# EAGLE schematic Compute_Bpard-V0.0 (EAGLE 9.6.2)

## Sheet 1 of 4
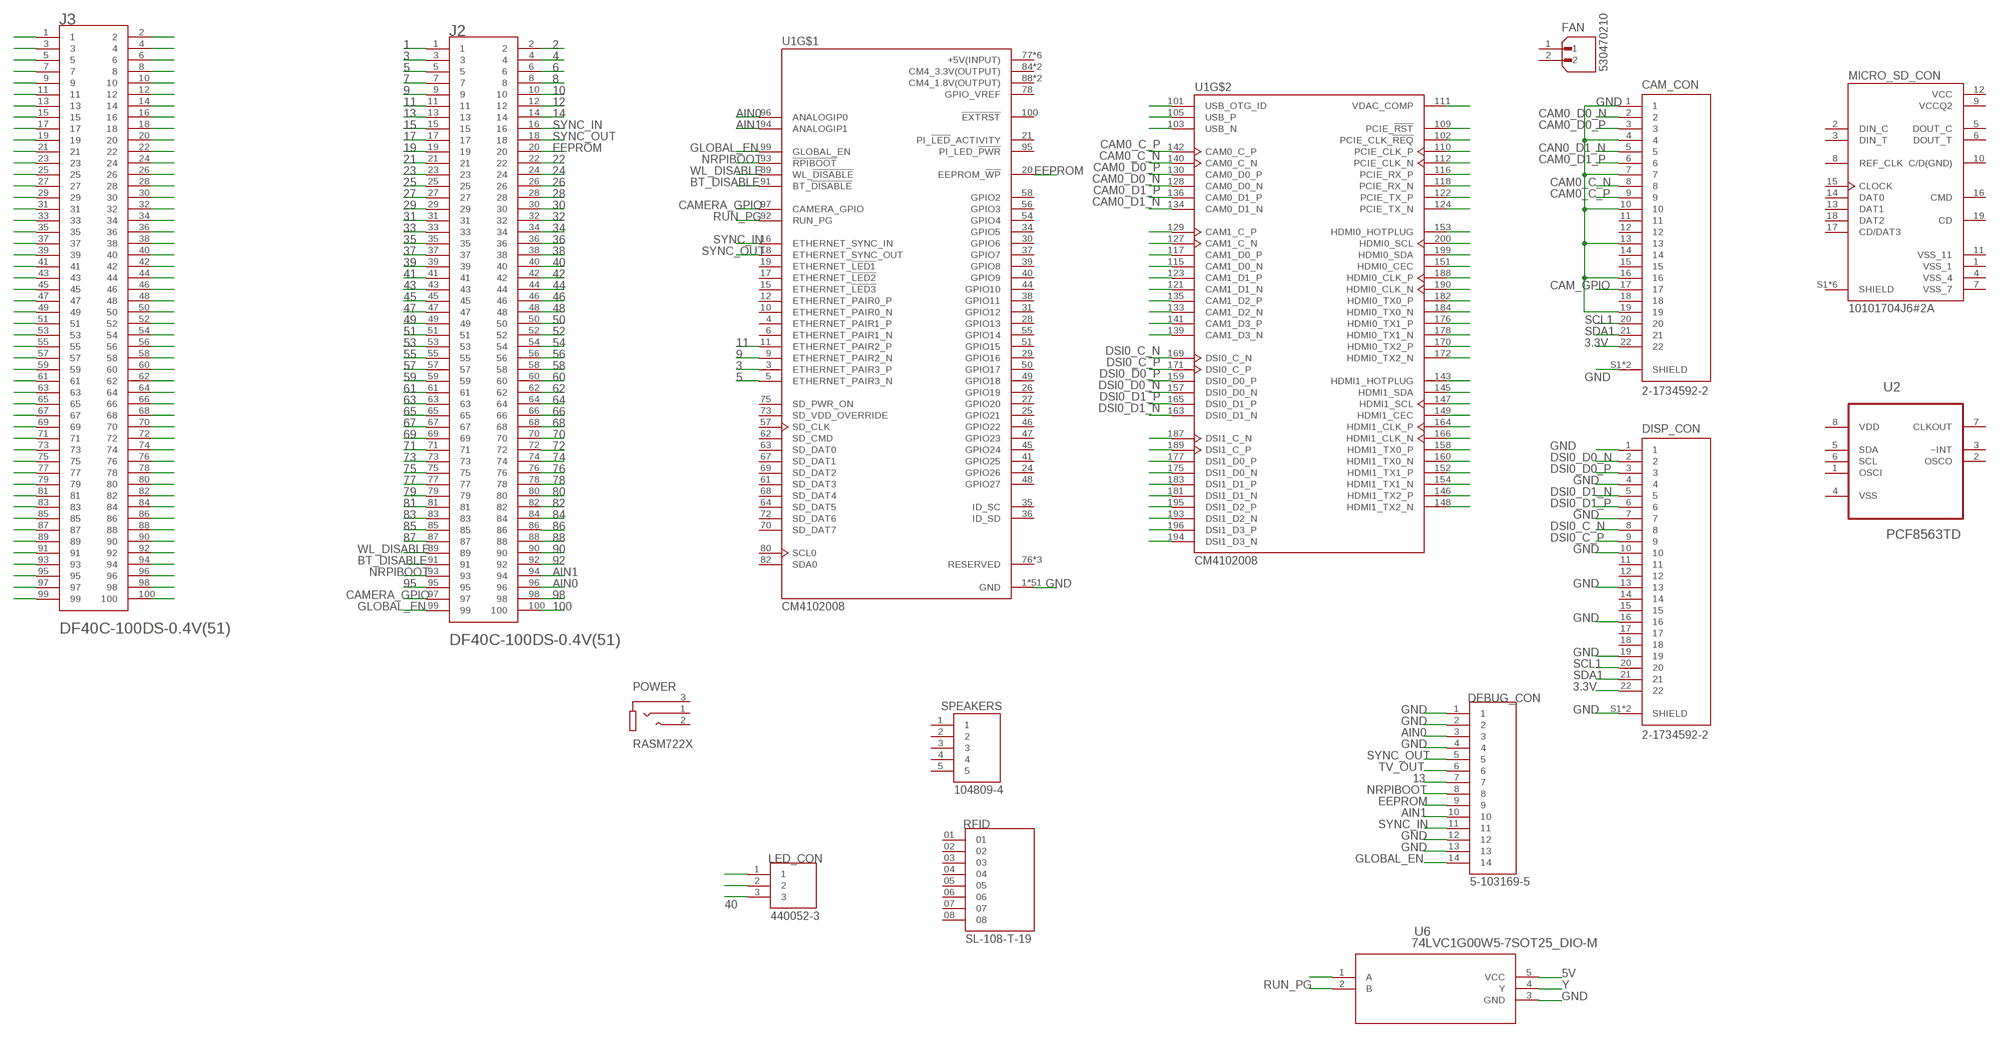
[diagram p0: schematic, sheet 1]

### Parts
CAM_CON  2-1734592-2  [TE_2-1734592-2]
DEBUG_CON  5-103169-5  [TE_5-103169-5]
DISP_CON  2-1734592-2  [TE_2-1734592-2]
FAN  530470210  [MOLEX_530470210]
J2  DF40C-100DS-0.4V(51)  [HRS_DF40C-100DS-0.4V(51)]
J3  DF40C-100DS-0.4V(51)  [HRS_DF40C-100DS-0.4V(51)]
LED_CON  440052-3  [TE_440052-3]
MICRO_SD_CON  10101704J6#2A  [AMPHENOL_10101704J6#2A]
POWER  RASM722X  [SWITCHCRAFT_RASM722X]
RFID  SL-108-T-19  [SAMTEC_SL-108-T-19]
SPEAKERS  104809-4  [TE_104809-4]
U1  CM4102008  [MODULE_CM4102008]
U2  PCF8563TD  [SOIC127P600X175-8N]
U6  74LVC1G00W5-7SOT25_DIO-M  [SOT25_DIO-M]

### Nets
1: J2.1
2: J2.2
3: J2.3 U1.3(ETHERNET_PAIR3_P)
3.3V: CAM_CON.22 DISP_CON.22
4: J2.4
5: J2.5 U1.5(ETHERNET_PAIR3_N)
5V: U6.5(VCC)
6: J2.6
7: J2.7
8: J2.8
9: J2.9 U1.9(ETHERNET_PAIR2_N)
10: J2.10
11: J2.11 U1.11(ETHERNET_PAIR2_P)
12: J2.12
13: DEBUG_CON.7 J2.13
14: J2.14
15: J2.15
17: J2.17
19: J2.19
21: J2.21
22: J2.22
23: J2.23
24: J2.24
25: J2.25
26: J2.26
27: J2.27
28: J2.28
29: J2.29
30: J2.30
31: J2.31
32: J2.32
33: J2.33
34: J2.34
35: J2.35
36: J2.36
37: J2.37
38: J2.38
39: J2.39
40: J2.40 LED_CON.3
41: J2.41
42: J2.42
43: J2.43
44: J2.44
45: J2.45
46: J2.46
47: J2.47
48: J2.48
49: J2.49
50: J2.50
51: J2.51
52: J2.52
53: J2.53
54: J2.54
55: J2.55
56: J2.56
57: J2.57
58: J2.58
59: J2.59
60: J2.60
61: J2.61
62: J2.62
63: J2.63
64: J2.64
65: J2.65
66: J2.66
67: J2.67
68: J2.68
69: J2.69
70: J2.70
71: J2.71
72: J2.72
73: J2.73
74: J2.74
75: J2.75
76: J2.76
77: J2.77
78: J2.78
79: J2.79
80: J2.80
81: J2.81
82: J2.82
83: J2.83
84: J2.84
85: J2.85
86: J2.86
87: J2.87
88: J2.88
90: J2.90
92: J2.92
95: J2.95
98: J2.98
100: J2.100
AIN0: DEBUG_CON.3 J2.96 U1.96(ANALOGIP0)
AIN1: DEBUG_CON.10 J2.94 U1.94(ANALOGIP1)
BT_DISABLE: J2.91 U1.91(BT_!DISABLE)
CAM0_C_N: CAM_CON.8 U1.140(CAM0_C_N)
CAM0_C_P: CAM_CON.9 U1.142(CAM0_C_P)
CAM0_D0_N: CAM_CON.2 U1.128(CAM0_D0_N)
CAM0_D0_P: CAM_CON.3 U1.130(CAM0_D0_P)
CAM0_D1_N: U1.134(CAM0_D1_N)
CAM0_D1_P: CAM_CON.6 U1.136(CAM0_D1_P)
CAM_GPIO: CAM_CON.17
CAMERA_GPIO: J2.97 U1.97(CAMERA_GPIO)
CAN0_D1_N: CAM_CON.5
DSI0_C_N: DISP_CON.8 U1.169(DSI0_C_N)
DSI0_C_P: DISP_CON.9 U1.171(DSI0_C_P)
DSI0_D0_N: DISP_CON.2 U1.157(DSI0_D0_N)
DSI0_D0_P: DISP_CON.3 U1.159(DSI0_D0_P)
DSI0_D1_N: DISP_CON.5 U1.163(DSI0_D1_N)
DSI0_D1_P: DISP_CON.6 U1.165(DSI0_D1_P)
EEPROM: DEBUG_CON.9 J2.20 U1.20(EEPROM_!WP)
GLOBAL_EN: DEBUG_CON.14 J2.99 U1.99(GLOBAL_EN)
GND: CAM_CON.1 CAM_CON.4 CAM_CON.7 CAM_CON.10 CAM_CON.13 CAM_CON.16 CAM_CON.19 CAM_CON.S1(SHIELD) CAM_CON.S2(SHIELD) DEBUG_CON.1 DEBUG_CON.2 DEBUG_CON.4 DEBUG_CON.12 DEBUG_CON.13 DISP_CON.1 DISP_CON.4 DISP_CON.7 DISP_CON.10 DISP_CON.13 DISP_CON.16 DISP_CON.19 DISP_CON.S1(SHIELD) DISP_CON.S2(SHIELD) U1.1(GND) U1.2(GND) U1.7(GND) U1.8(GND) U1.13(GND) U1.14(GND) U1.22(GND) U1.23(GND) U1.32(GND) U1.33(GND) U1.42(GND) U1.43(GND) U1.52(GND) U1.53(GND) U1.59(GND) U1.60(GND) U1.65(GND) U1.66(GND) U1.71(GND) U1.74(GND) U1.98(GND) U1.107(GND) U1.108(GND) U1.113(GND) U1.114(GND) U1.119(GND) U1.120(GND) U1.125(GND) U1.126(GND) U1.131(GND) U1.132(GND) U1.137(GND) U1.138(GND) U1.144(GND) U1.150(GND) U1.155(GND) U1.156(GND) U1.161(GND) U1.162(GND) U1.167(GND) U1.168(GND) U1.173(GND) U1.174(GND) U1.179(GND) U1.180(GND) U1.185(GND) U1.186(GND) U1.191(GND) U1.192(GND) U1.197(GND) U1.198(GND) U6.3(GND) ; also sheet 2
N$11: U6.1(A)
N$12: LED_CON.2
N$13: LED_CON.1
N$54: U1.101(USB_OTG_ID) U1.102(PCIE_CLK_!REQ) U1.103(USB_N) U1.105(USB_P) U1.109(PCIE_!RST) U1.110(PCIE_CLK_P) U1.111(VDAC_COMP) U1.112(PCIE_CLK_N) U1.115(CAM1_D0_N) U1.116(PCIE_RX_P) U1.117(CAM1_D0_P) U1.118(PCIE_RX_N) U1.121(CAM1_D1_N) U1.122(PCIE_TX_P) U1.123(CAM1_D1_P) U1.124(PCIE_TX_N) U1.127(CAM1_C_N) U1.129(CAM1_C_P) U1.133(CAM1_D2_N) U1.135(CAM1_D2_P) U1.139(CAM1_D3_N) U1.141(CAM1_D3_P) U1.143(HDMI1_HOTPLUG) U1.145(HDMI1_SDA) U1.146(HDMI1_TX2_P) U1.147(HDMI1_SCL) U1.148(HDMI1_TX2_N) U1.149(HDMI1_CEC) U1.151(HDMI0_CEC) U1.152(HDMI1_TX1_P) U1.153(HDMI0_HOTPLUG) U1.154(HDMI1_TX1_N) U1.158(HDMI1_TX0_P) U1.160(HDMI1_TX0_N) U1.164(HDMI1_CLK_P) U1.166(HDMI1_CLK_N) U1.170(HDMI0_TX2_P) U1.172(HDMI0_TX2_N) U1.175(DSI1_D0_N) U1.176(HDMI0_TX1_P) U1.177(DSI1_D0_P) U1.178(HDMI0_TX1_N) U1.181(DSI1_D1_N) U1.182(HDMI0_TX0_P) U1.183(DSI1_D1_P) U1.184(HDMI0_TX0_N) U1.187(DSI1_C_N) U1.188(HDMI0_CLK_P) U1.189(DSI1_C_P) U1.190(HDMI0_CLK_N) U1.193(DSI1_D2_N) U1.194(DSI1_D3_N) U1.195(DSI1_D2_P) U1.196(DSI1_D3_P) U1.199(HDMI0_SDA) U1.200(HDMI0_SCL)
N$69: J3.1 J3.3 J3.5 J3.7 J3.9 J3.11 J3.13 J3.15 J3.17 J3.19 J3.21
N$70: J3.23 J3.25 J3.27 J3.29 J3.31 J3.33 J3.35 J3.37 J3.39 J3.41 J3.43
N$71: J3.45 J3.47 J3.49 J3.51 J3.53 J3.55 J3.57 J3.59 J3.61 J3.63 J3.65
N$72: J3.67 J3.69 J3.71 J3.73 J3.75 J3.77 J3.79 J3.81 J3.83 J3.85 J3.87
N$73: J3.89 J3.91 J3.93 J3.95 J3.97 J3.99
N$82: J3.2
N$83: J3.4
N$84: J3.6
N$85: J3.8
N$86: J3.10
N$87: J3.12
N$88: J3.14
N$89: J3.16
N$90: J3.18
N$91: J3.20
N$92: J3.22
N$93: J3.24
N$94: J3.26
N$95: J3.28
N$96: J3.30
N$97: J3.32
N$98: J3.34
N$99: J3.36
N$100: J3.38
N$101: J3.40
N$102: J3.42
N$103: J3.44
N$104: J3.46
N$105: J3.48
N$106: J3.50
N$107: J3.52
N$108: J3.54
N$109: J3.56
N$110: J3.58
N$111: J3.60
N$112: J3.62
N$113: J3.64
N$114: J3.66
N$115: J3.68
N$116: J3.70
N$117: J3.72
N$118: J3.74
N$119: J3.76
N$120: J3.78
N$121: J3.80
N$122: J3.82
N$123: J3.84
N$124: J3.86
N$125: J3.88
N$126: J3.90
N$127: J3.92
N$128: J3.94
N$129: J3.96
N$130: J3.98
N$131: J3.100
NRPIBOOT: DEBUG_CON.8 J2.93 U1.93(!RPIBOOT)
RUN_PG: U1.92(RUN_PG) U6.2(B)
SCL1: CAM_CON.20 DISP_CON.20
SDA1: CAM_CON.21 DISP_CON.21
SYNC_IN: DEBUG_CON.11 J2.16 U1.16(ETHERNET_SYNC_IN)
SYNC_OUT: DEBUG_CON.5 J2.18 U1.18(ETHERNET_SYNC_OUT)
TV_OUT: DEBUG_CON.6
WL_DISABLE: J2.89 U1.89(WL_!DISABLE)
Y: U6.4(Y)
Unconnected: CAM_CON.11 CAM_CON.12 CAM_CON.14 CAM_CON.15 CAM_CON.18 DISP_CON.11 DISP_CON.12 DISP_CON.14 DISP_CON.15 DISP_CON.17 DISP_CON.18 FAN.1 FAN.2 MICRO_SD_CON.2(DIN_C) MICRO_SD_CON.3(DIN_T) MICRO_SD_CON.5(DOUT_C) MICRO_SD_CON.6(DOUT_T) MICRO_SD_CON.8(REF_CLK) MICRO_SD_CON.10(C/D(GND)) MICRO_SD_CON.13(DAT1) MICRO_SD_CON.14(DAT0) MICRO_SD_CON.15(CLOCK) MICRO_SD_CON.16(CMD) MICRO_SD_CON.17(CD/DAT3) MICRO_SD_CON.18(DAT2) MICRO_SD_CON.19(CD) MICRO_SD_CON.S1(SHIELD) MICRO_SD_CON.S2(SHIELD) MICRO_SD_CON.S3(SHIELD) MICRO_SD_CON.S4(SHIELD) MICRO_SD_CON.S5(SHIELD) MICRO_SD_CON.S6(SHIELD) POWER.1(SHUNT) POWER.2(TIP) POWER.3(SLEEVE) RFID.01 RFID.02 RFID.03 RFID.04 RFID.05 RFID.06 RFID.07 RFID.08 SPEAKERS.1 SPEAKERS.2 SPEAKERS.3 SPEAKERS.4 SPEAKERS.5 U1.4(ETHERNET_PAIR1_P) U1.6(ETHERNET_PAIR1_N) U1.10(ETHERNET_PAIR0_N) U1.12(ETHERNET_PAIR0_P) U1.15(ETHERNET_!LED3) U1.17(ETHERNET_!LED2) U1.19(ETHERNET_!LED1) U1.21(PI_!LED!_ACTIVITY) U1.24(GPIO26) U1.25(GPIO21) U1.26(GPIO19) U1.27(GPIO20) U1.28(GPIO13) U1.29(GPIO16) U1.30(GPIO6) U1.31(GPIO12) U1.34(GPIO5) U1.35(ID_SC) U1.36(ID_SD) U1.37(GPIO7) U1.38(GPIO11) U1.39(GPIO8) U1.40(GPIO9) U1.41(GPIO25) U1.44(GPIO10) U1.45(GPIO24) U1.46(GPIO22) U1.47(GPIO23) U1.48(GPIO27) U1.49(GPIO18) U1.50(GPIO17) U1.51(GPIO15) U1.54(GPIO4) U1.55(GPIO14) U1.56(GPIO3) U1.57(SD_CLK) U1.58(GPIO2) U1.61(SD_DAT3) U1.62(SD_CMD) U1.63(SD_DAT0) U1.64(SD_DAT5) U1.67(SD_DAT1) U1.68(SD_DAT4) U1.69(SD_DAT2) U1.70(SD_DAT7) U1.72(SD_DAT6) U1.73(SD_VDD_OVERRIDE) U1.75(SD_PWR_ON) U1.76(RESERVED) U1.80(SCL0) U1.82(SDA0) U1.95(PI_LED_!PWR) U1.100(!EXTRST) U1.104(RESERVED) U1.106(RESERVED) U2.1(OSCI) U2.2(OSCO) U2.3(~INT) U2.5(SDA) U2.6(SCL) U2.7(CLKOUT)

## Sheet 2 of 4
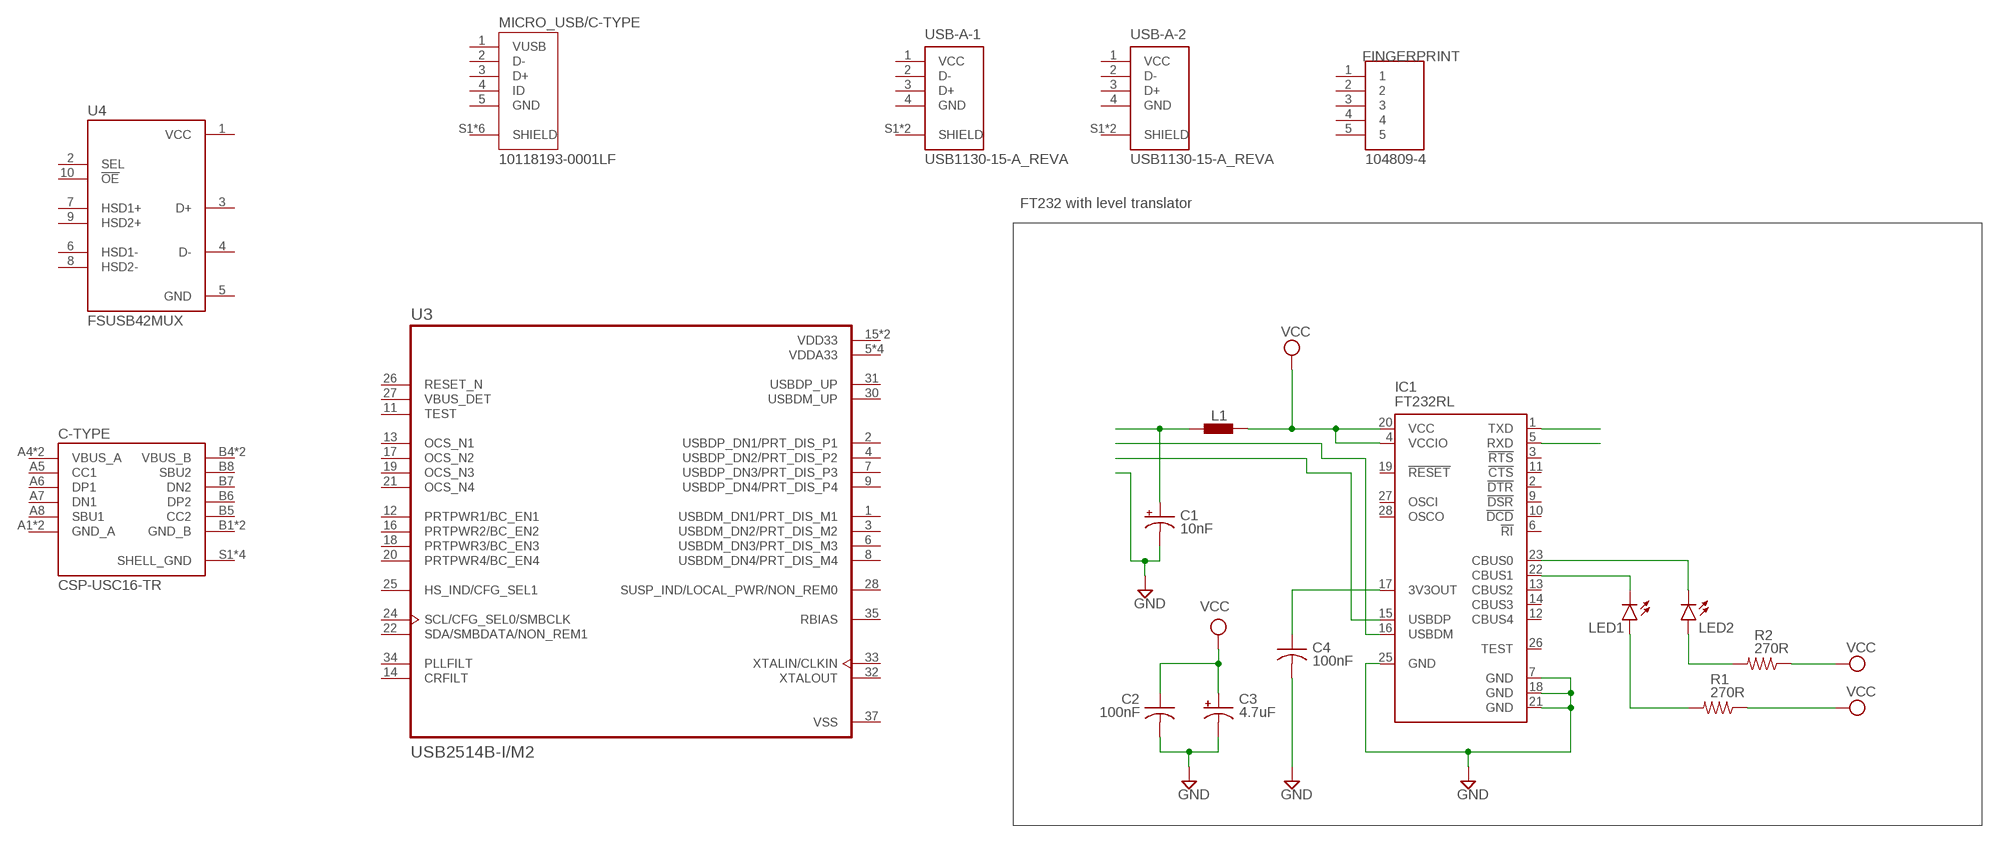
[diagram p1: schematic, sheet 2]

### Parts
C1  10nF  CPOL-US085CS-1AR  [085CS_1AR]
C2  100nF  C-US025-024X044  [C025-024X044]
C3  4.7uF  CPOL-US085CS-1AR  [085CS_1AR]
C4  100nF  C-US025-024X044  [C025-024X044]
C-TYPE  CSP-USC16-TR  [VALCON_CSP-USC16-TR]
FINGERPRINT  104809-4  [TE_104809-4]
IC1  FT232RL  [SSOP28]
L1  BLM15HB121SN1  [0402]
LED1  LEDSMT1206  [1206]
LED2  LEDSMT1206  [1206]
MICRO_USB/C-TYPE  10118193-0001LF  [FCI_10118193-0001LF]
R1  270R  R-US_0204/2V  [0204V]
R2  270R  R-US_0204/2V  [0204V]
U3  USB2514B-I/M2  [QFN50P600X600X100-37N]
U4  FSUSB42MUX  [SOP50P490X110-10N]
USB-A-1  USB1130-15-A_REVA  [GCT_USB1130-15-A_REVA]
USB-A-2  USB1130-15-A_REVA  [GCT_USB1130-15-A_REVA]

### Nets
GND: C1.- C2.2 C3.- C4.2 IC1.7(GND) IC1.18(GND) IC1.21(GND) IC1.25(GND) ; also sheet 1
N$1: C1.+ L1.1
N$2: IC1.16(USBDM)
N$3: IC1.15(USBDP)
N$4: C4.1 IC1.17(3V3OUT)
N$5: IC1.1(TXD)
N$6: IC1.5(RXD)
N$7: LED2.A R2.2
N$8: LED1.A R1.2
N$9: IC1.23(CBUS0) LED2.C
N$10: IC1.22(CBUS1) LED1.C
VCC: C2.1 C3.+ IC1.4(VCCIO) IC1.20(VCC) L1.2 R1.1 R2.1
Unconnected: C-TYPE.A5(CC1) C-TYPE.A6(DP1) C-TYPE.A7(DN1) C-TYPE.A8(SBU1) C-TYPE.B5(CC2) C-TYPE.B6(DP2) C-TYPE.B7(DN2) C-TYPE.B8(SBU2) FINGERPRINT.1 FINGERPRINT.2 FINGERPRINT.3 FINGERPRINT.4 FINGERPRINT.5 IC1.2(!DTR) IC1.3(!RTS) IC1.6(!RI) IC1.9(!DSR) IC1.10(!DCD) IC1.11(!CTS) IC1.12(CBUS4) IC1.13(CBUS2) IC1.14(CBUS3) IC1.19(!RESET) IC1.26(TEST) IC1.27(OSCI) IC1.28(OSCO) MICRO_USB/C-TYPE.1(VUSB) MICRO_USB/C-TYPE.2(D-) MICRO_USB/C-TYPE.3(D+) MICRO_USB/C-TYPE.4(ID) MICRO_USB/C-TYPE.5(GND) MICRO_USB/C-TYPE.S1(SHIELD) MICRO_USB/C-TYPE.S2(SHIELD) MICRO_USB/C-TYPE.S3(SHIELD) MICRO_USB/C-TYPE.S4(SHIELD) MICRO_USB/C-TYPE.S5(SHIELD) MICRO_USB/C-TYPE.S6(SHIELD) U3.1(USBDM_DN1/PRT_DIS_M1) U3.2(USBDP_DN1/PRT_DIS_P1) U3.3(USBDM_DN2/PRT_DIS_M2) U3.4(USBDP_DN2/PRT_DIS_P2) U3.6(USBDM_DN3/PRT_DIS_M3) U3.7(USBDP_DN3/PRT_DIS_P3) U3.8(USBDM_DN4/PRT_DIS_M4) U3.9(USBDP_DN4/PRT_DIS_P4) U3.11(TEST) U3.12(PRTPWR1/BC_EN1) U3.13(OCS_N1) U3.14(CRFILT) U3.16(PRTPWR2/BC_EN2) U3.17(OCS_N2) U3.18(PRTPWR3/BC_EN3) U3.19(OCS_N3) U3.20(PRTPWR4/BC_EN4) U3.21(OCS_N4) U3.22(SDA/SMBDATA/NON_REM1) U3.24(SCL/CFG_SEL0/SMBCLK) U3.25(HS_IND/CFG_SEL1) U3.26(RESET_N) U3.27(VBUS_DET) U3.28(SUSP_IND/LOCAL_PWR/NON_REM0) U3.30(USBDM_UP) U3.31(USBDP_UP) U3.32(XTALOUT) U3.33(XTALIN/CLKIN) U3.34(PLLFILT) U3.35(RBIAS) U4.2(SEL) U4.3(D+) U4.4(D-) U4.6(HSD1-) U4.7(HSD1+) U4.8(HSD2-) U4.9(HSD2+) U4.10(!OE) USB-A-1.2(D-) USB-A-1.3(D+) USB-A-1.S1(SHIELD) USB-A-1.S2(SHIELD) USB-A-2.2(D-) USB-A-2.3(D+) USB-A-2.S1(SHIELD) USB-A-2.S2(SHIELD)

### Notes on the sheet
- FT232 with level translator

## Sheet 3 of 4
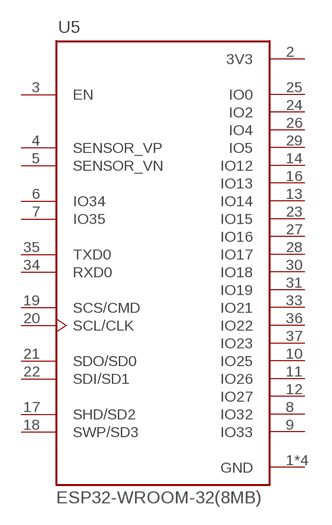
[diagram p2: schematic, sheet 3]

### Parts
U5  ESP32-WROOM-32(8MB)  [MODULE_ESP32-WROOM-32(8MB)]
Unconnected: U5.3(EN) U5.4(SENSOR_VP) U5.5(SENSOR_VN) U5.6(IO34) U5.7(IO35) U5.8(IO32) U5.9(IO33) U5.10(IO25) U5.11(IO26) U5.12(IO27) U5.13(IO14) U5.14(IO12) U5.16(IO13) U5.17(SHD/SD2) U5.18(SWP/SD3) U5.19(SCS/CMD) U5.20(SCL/CLK) U5.21(SDO/SD0) U5.22(SDI/SD1) U5.23(IO15) U5.24(IO2) U5.25(IO0) U5.26(IO4) U5.27(IO16) U5.28(IO17) U5.29(IO5) U5.30(IO18) U5.31(IO19) U5.33(IO21) U5.34(RXD0) U5.35(TXD0) U5.36(IO22) U5.37(IO23)

## Sheet 4 of 4
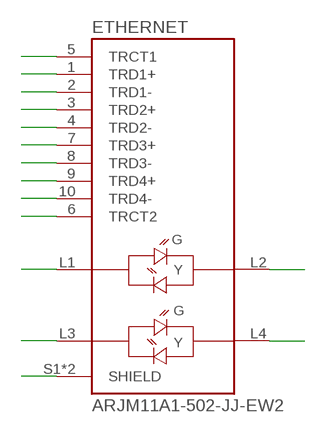
[diagram p3: schematic, sheet 4]

### Parts
ETHERNET  ARJM11A1-502-JJ-EW2  [ABRACON_ARJM11A1-502-JJ-EW2]

### Nets
N$24: ETHERNET.5(TRCT1)
N$25: ETHERNET.1(TRD1+)
N$26: ETHERNET.2(TRD1-)
N$27: ETHERNET.3(TRD2+)
N$28: ETHERNET.4(TRD2-)
N$29: ETHERNET.7(TRD3+)
N$30: ETHERNET.8(TRD3-)
N$31: ETHERNET.9(TRD4+)
N$32: ETHERNET.10(TRD4-)
N$33: ETHERNET.6(TRCT2)
N$34: ETHERNET.L1
N$35: ETHERNET.L2
N$36: ETHERNET.L3
N$37: ETHERNET.L4
N$38: ETHERNET.S1(SHIELD) ETHERNET.S2(SHIELD)

## Power pins joined to a net without a drawn wire
3V3: U5.2(3V3)
+5V(INPUT): U1.77(+5V(INPUT)) U1.79(+5V(INPUT)) U1.81(+5V(INPUT)) U1.83(+5V(INPUT)) U1.85(+5V(INPUT)) U1.87(+5V(INPUT))
CM4_1.8V(OUTPUT): U1.88(CM4_1.8V(OUTPUT)) U1.90(CM4_1.8V(OUTPUT))
CM4_3.3V(OUTPUT): U1.84(CM4_3.3V(OUTPUT)) U1.86(CM4_3.3V(OUTPUT))
GND: U4.5(GND) U5.1(GND) U5.15(GND) U5.38(GND) U5.39(GND) USB-A-1.4(GND) USB-A-2.4(GND)
GND_A: C-TYPE.A1(GND_A) C-TYPE.A12(GND_A)
GND_B: C-TYPE.B1(GND_B) C-TYPE.B12(GND_B)
GPIO_VREF: U1.78(GPIO_VREF)
SHELL_GND: C-TYPE.S1(SHELL_GND) C-TYPE.S2(SHELL_GND) C-TYPE.S3(SHELL_GND) C-TYPE.S4(SHELL_GND)
VBUS_A: C-TYPE.A4(VBUS_A) C-TYPE.A9(VBUS_A)
VBUS_B: C-TYPE.B4(VBUS_B) C-TYPE.B9(VBUS_B)
VCC: MICRO_SD_CON.12(VCC) U4.1(VCC) USB-A-1.1(VCC) USB-A-2.1(VCC)
VCCQ2: MICRO_SD_CON.9(VCCQ2)
VDD: U2.8(VDD)
VDD33: U3.15(VDD33) U3.23(VDD33)
VDDA33: U3.5(VDDA33) U3.10(VDDA33) U3.29(VDDA33) U3.36(VDDA33)
VSS: U2.4(VSS) U3.37(VSS)
VSS_1: MICRO_SD_CON.1(VSS_1)
VSS_4: MICRO_SD_CON.4(VSS_4)
VSS_7: MICRO_SD_CON.7(VSS_7)
VSS_11: MICRO_SD_CON.11(VSS_11)

## Library data of the parts
C1 C3 = rcl:CPOL-US: POLARIZED CAPACITOR, American symbol; SPICEPREFIX: C
C2 C4 = rcl:C-US: CAPACITOR, American symbol; SPICEPREFIX: C
C-TYPE = USB-C:CSP-USC16-TR: Check availability <https://pricing.snapeda.com/parts/CSP-USC16-TR/Valcon/view-part?ref=eda>; AVAILABILITY: In Stock; DESCRIPTION: CSP-USC16-TR Valcon USB Type C Surface Mount PCB Socket; MF: Valcon; MP: CSP-USC16-TR; PACKAGE: None; PRICE: None; PURCHASE-URL: https://pricing.snapeda.com/search/part/CSP-USC16-TR/?ref=eda
CAM_CON DISP_CON = 2-1734592-2:2-1734592-2: Check availability <https://pricing.snapeda.com/parts/2-1734592-2/TE%20Connectivity/view-part?ref=eda>; AVAILABILITY: In Stock; DESCRIPTION: 22 Position FPC Connector Contacts, Bottom 0.020 (0.50mm) Surface Mount, Right Angle; MF: TE Connectivity; MP: 2-1734592-2; PACKAGE: None; PRICE: None; PURCHASE-URL: https://pricing.snapeda.com/search/part/2-1734592-2/?ref=eda
DEBUG_CON = 5-103169-5:5-103169-5: Check availability <https://pricing.snapeda.com/parts/5-103169-5/TE%20Connectivity/view-part?ref=eda>; AVAILABILITY: In Stock; COMMENT: 5-103169-5; DESCRIPTION: AMPMODU 14 Position Through-Hole Dual Row Straight 2.54 mm Shrouded Header; EU_ROHS_COMPLIANCE: Compliant; MF: TE Connectivity; MP: 5-103169-5; PACKAGE: None; PRICE: None; PURCHASE-URL: https://pricing.snapeda.com/search/part/5-103169-5/?ref=eda
ETHERNET = ARJM11A1-502-JJ-EW2:ARJM11A1-502-JJ-EW2: 1 Port RJ45 Magjack Connector Through Hole 10/100/1000 Base-T, AutoMDIX Check availability <https://pricing.snapeda.com/parts/ARJM11A1-502-JJ-EW2/Abracon%20LLC/view-part?ref=eda>; AVAILABILITY: In Stock; DESCRIPTION: 1 Port RJ45 Magjack Connector Through Hole 10/100/1000 Base-T, AutoMDIX; MF: Abracon LLC; MP: ARJM11A1-502-JJ-EW2; PACKAGE: None; PRICE: None; PURCHASE-URL: https://pricing.snapeda.com/search/part/ARJM11A1-502-JJ-EW2/?ref=eda
FAN = 530470210:530470210: Check availability <https://pricing.snapeda.com/parts/530470210/Molex/view-part?ref=eda>; AVAILABILITY: In Stock; DESCRIPTION: Connector Header Through Hole 2 position 0.049 (1.25mm); MF: Molex; MP: 530470210; PACKAGE: None; PRICE: None; PURCHASE-URL: https://pricing.snapeda.com/search/part/530470210/?ref=eda
FINGERPRINT SPEAKERS = 104809-4:104809-4: Check availability <https://pricing.snapeda.com/parts/104809-4/TE%20Connectivity%20AMP%20Connectors/view-part?ref=eda>; AVAILABILITY: In Stock; COMMENT: 104809-4; DESCRIPTION: Connector Header Through Hole 5 position 0.100 (2.54mm); MF: TE Connectivity AMP Connectors; MP: 104809-4; PACKAGE: None; PRICE: None; PURCHASE-URL: https://pricing.snapeda.com/search/part/104809-4/?ref=eda
IC1 = ftdichip:FT232R: Source: http://www.ftdichip.com/Documents/DataSheets/DS_FT232R_v104.pdf; MPN: FT232RL; OC_FARNELL: 1146032; OC_NEWARK: 91K9918
J2 J3 = DF40C-100DS-0.4V_51_:DF40C-100DS-0.4V(51): DF40 Series 100 Position Dual Row 0.4 mm Pitch Surface Mount Vertical Receptacle Check availability <https://pricing.snapeda.com/parts/DF40C-100DS-0.4V%2851%29/Hirose/view-part?ref=eda>; AVAILABILITY: In Stock; DESCRIPTION: 100 Position Connector Receptacle, Center Strip Contacts Surface Mount Gold; MF: Hirose; MP: DF40C-100DS-0.4V(51); PACKAGE: None; PRICE: None; PURCHASE-URL: https://pricing.snapeda.com/search/part/DF40C-100DS-0.4V(51)/?ref=eda
L1 = inductors:BLM15H: EMIFIL (R) Chip Ferrite Bead for GHz Noise Source: http://www.murata.com/ Ferrite Bead BLM15H.pdf
LED1 LED2 = led:LED: LED OSRAM: - CHIPLED LG R971, LG N971, LY N971, LG Q971, LY Q971, LO R971, LY R971 LH N974, LH R974 LS Q976, LO Q976, LY Q976 LO Q996 - Hyper CHIPLED LW Q18S LB Q993, LB Q99A, LB R99A - SideLED LS A670, LO A670, LY A670, LG A670, LP A670 LB A673, LV A673, LT A673, LW A673 LH A674 LY A675 LS A676, LA A676, LO A676, LY A676, LW A676 LS A679, LY A679, LG A679 - Hyper Micro SIDELED® LS Y876, LA Y876, LO Y876, LY Y876 LT Y87S - SmartLED LW L88C, LW L88S LB L89C, LB L89S, LG L890 LS L89K, LO L89K, LY L89K LS L896, LA L896, LO L896, LY L896 - TOPLED LS T670, LO T670, LY T670, LG T670, LP T670 LSG T670, LSP T670, LSY T670, LOP T670, LYG T670 LG T671, LOG T671, LSG T671 LB T673, LV T673, LT T673, LW T673 LH T674 LS T676, LA T676, LO T676, LY T676, LB T676, LH T676, LSB T676, LW T676 LB T67C, LV T67C, LT T67C, LS T67K, LO T67K, LY T67K, LW E67C LS E67B, LA E67B, LO E67B, LY E67B, LB E67C, LV E67C, LT E67C LW T67C LS T679, LY T679, LG T679 LS T770, LO T770, LY T770, LG T770, LP T770 LB T773, LV T773, LT T773, LW T773 LH T774 LS E675, LA E675, LY E675, LS T675 LS T776, LA T776, LO T776, LY T776, LB T776 LHGB T686 LT T68C, LB T68C - Hyper Mini TOPLED® LB M676 - Mini TOPLED Santana® LG M470 LS M47K, LO M47K, LY M47K Source: http://www.osram.convergy.de LUXEON: - LUMILED® LXK2-PW12-R00, LXK2-PW12-S00, LXK2-PW14-U00, LXK2-PW14-V00 LXK2-PM12-R00, LXK2-PM12-S00, LXK2-PM14-U00 LXK2-PE12-Q00, LXK2-PE12-R00, LXK2-PE12-S00, LXK2-PE14-T00, LXK2-PE14-U00 LXK2-PB12-K00, LXK2-PB12-L00, LXK2-PB12-M00, LXK2-PB14-N00, LXK2-PB14-P00, LXK2-PB14-Q00 LXK2-PR12-L00, LXK2-PR12-M00, LXK2-PR14-Q00, LXK2-PR14-R00 LXK2-PD12-Q00, LXK2-PD12-R00, LXK2-PD12-S00 LXK2-PH12-R00, LXK2-PH12-S00 LXK2-PL12-P00, LXK2-PL12-Q00, LXK2-PL12-R00 Source: www.luxeon.com KINGBRIGHT: KA-3528ASYC Source: www.kingbright.com
LED_CON = 440052-3:440052-3: Check availability <https://pricing.snapeda.com/parts/440052-3/TE%20Connectivity/view-part?ref=eda>; AVAILABILITY: In Stock; COMMENT: 440052-3; DESCRIPTION: 2.5MM,HDR,3POS,VERTICAL, CONNECTOR; EU_ROHS_COMPLIANCE: Compliant; MF: TE Connectivity; MP: 440052-3; PACKAGE: None; PRICE: None; PURCHASE-URL: https://pricing.snapeda.com/search/part/440052-3/?ref=eda
MICRO_SD_CON = SD_Card:10101704J6#2A: Check availability <https://pricing.snapeda.com/parts/10101704J6%232A/Amphenol%20Commercial%20Products/view-part?ref=eda>; AVAILABILITY: In Stock; DESCRIPTION: Universal Flash Storage (UFS) Connector, Input Output Connectors, UFS card high speed Socket, push-pull, SMT,compatible with Micro SD, Pd-NI 12μin +2μin gold.; MF: Amphenol Commercial Products; MP: 10101704J6#2A; PACKAGE: None; PRICE: None; PURCHASE-URL: https://pricing.snapeda.com/search/part/10101704J6#2A/?ref=eda
MICRO_USB/C-TYPE = Micro_USB:10118193-0001LF: Micro USB B Type Receptacle Check availability <https://pricing.snapeda.com/parts/10118193-0001LF/FCI/view-part?ref=eda>; AVAILABILITY: In Stock; DESCRIPTION: USB - micro B USB 2.0 Receptacle Connector 5 Position Surface Mount, Right Angle; Through Hole; MF: FCI; MP: 10118193-0001LF; PACKAGE: None; PRICE: None; PURCHASE-URL: https://pricing.snapeda.com/search/part/10118193-0001LF/?ref=eda
POWER = RASM722X:RASM722X: Check availability <https://pricing.snapeda.com/parts/RASM722X/Switchcraft/view-part?ref=eda>; AVAILABILITY: In Stock; DESCRIPTION: JACK SOCKET, DC; Gender:Jack; Current Rating:5A; Pin Diameter:2mm; Barrel Length:-; Connector Mounting:Surface Mount; Contact Termination Type:Solder; Barrel Inner Diameter:-; Barrel Outer Diameter:6.3mm; Voltage Rating:-; Product Range:-; SVHC:No SVHC (15-Jan-2018); Contact Termination:Solder; Termination Method:Solder; Voltage Rating VAC:250V; MF: Switchcraft; MP: RASM722X; PACKAGE: None; PRICE: None; PURCHASE-URL: https://pricing.snapeda.com/search/part/RASM722X/?ref=eda
R1 R2 = rcl:R-US_: RESISTOR, American symbol; SPICEPREFIX: R
RFID = SL-108-T-19:SL-108-T-19: Check availability <https://pricing.snapeda.com/parts/SL-108-T-19/Samtec/view-part?ref=eda>; AVAILABILITY: In Stock; DESCRIPTION: 8 Position Receptacle Connector 0.100 (2.54mm) Through Hole Gold; MF: Samtec; MP: SL-108-T-19; PACKAGE: None; PRICE: None; PURCHASE-URL: https://pricing.snapeda.com/search/part/SL-108-T-19/?ref=eda
U1 = RPi-CM4102008:CM4102008: RPI MODULE 4, 2GB RAM, 8GB EMMC, WIFI; Silicon Manufacturer:Broadcom; Silicon Family Name:BCM2xxx; Core Architecture:ARM; Core Sub-Architecture:Cortex-A72; Silicon Core Number:BCM2711; Product Range:Compute Module 4 RoHS Compliant: Yes Check availability <https://pricing.snapeda.com/parts/CM4102008/Raspberry%20Pi/view-part?ref=eda>; AVAILABILITY: Not in stock; DESCRIPTION: RPI MODULE 4, 2GB RAM, 8GB EMMC, WIFI; Silicon Manufacturer:Broadcom; Silicon Family Name:BCM2xxx; Core Architecture:ARM; Core Sub-Architecture:Cortex-A72; Silicon Core Number:BCM2711; Product Range:Compute Module 4 RoHS Compliant: Yes; MF: Raspberry Pi; MP: CM4102008; PACKAGE: None; PRICE: None
U2 = PCF8563TD:PCF8563TD: Real time clock/calendar Check availability <https://pricing.snapeda.com/parts/PCF8563TD/NXP%20USA/view-part?ref=eda>; AVAILABILITY: Not in stock; DESCRIPTION: Real Time Clock (RTC) IC; Date Format:Binary; Time Format:BCD; Interface:I2C; RTC Features:Provides year, month, day, weekday, hours, minutes and seconds; Clock IC Type:RTC; Supply Voltage Min:1.8V; Supply Voltage Max:5.5V ;RoHS Compliant: Yes; MF: NXP USA; MP: PCF8563TD; PACKAGE: SOIC-8 NXP Semiconductors; PRICE: None
U3 = USB2514B-I_M2:USB2514B-I/M2: None Check availability <https://pricing.snapeda.com/parts/USB2514B-I/M2/Microchip/view-part?ref=eda>; AVAILABILITY: In Stock; DESCRIPTION: USB Hub Controller - USB Interface 36-SQFN (6x6); MF: Microchip; MP: USB2514B-I/M2; PACKAGE: VQFN-36 Microchip; PRICE: None; PURCHASE-URL: https://pricing.snapeda.com/search/part/USB2514B-I/M2/?ref=eda
U4 = FSUSB42MUX:FSUSB42MUX: Low Power, Two port, High speed, USB 2.0(480Mbps) UART switch MSOP-10 Check availability <https://pricing.snapeda.com/parts/FSUSB42MUX/ON%20Semiconductor/view-part?ref=eda>; AVAILABILITY: In Stock; DESCRIPTION: FSUSB42 Series DPDT 4.3 V 480 Mbps SMT Hi Speed USB 2.0 Switch - MSOP-10; MF: ON Semiconductor; MP: FSUSB42MUX; PACKAGE: MSOP-10 ON Semiconductor; PRICE: None; PURCHASE-URL: https://pricing.snapeda.com/search/part/FSUSB42MUX/?ref=eda
U5 = ESP32-WROOM-32_8MB_:ESP32-WROOM-32(8MB): WIFI MODULE 64 MBITS SPI FLASH Check availability <https://pricing.snapeda.com/parts/ESP32-WROOM-32%20%288MB%29/Espressif%20Systems/view-part?ref=eda>; AVAILABILITY: Not in stock; DESCRIPTION: Bluetooth, WiFi 802.11b/g/n, Bluetooth v4.2 +EDR, Class 1, 2 and 3 Transceiver Module 2.4GHz ~ 2.5GHz Antenna Not Included, U.FL Surface Mount; MF: Espressif Systems; MP: ESP32-WROOM-32 (8MB); PACKAGE: Module Espressif Systems; PRICE: None
U6 = buffer-wake-ic:74LVC1G00W5-7: Single Buffer 1 bit ouput drain- for wakeup function on rpi; COPYRIGHT: Copyright (C) 2023 Ultra Librarian. All rights reserved.; MANUFACTURER_PART_NUMBER: 74LVC1G00W5-7; MFR_NAME: Diodes Inc
USB-A-1 USB-A-2 = USB_A-Horizontal:USB1130-15-A_REVA: Check availability <https://pricing.snapeda.com/parts/USB1130-15-A/Global%20Connector%20Technology/view-part?ref=eda>; AVAILABILITY: In Stock; DESCRIPTION: USB 2.0 Connector Full size Horizontal Plug, type A, 4 Pins, Through hole, Top mount, 6.99mm profile, High mating cycle, charging receptacle; MF: Global Connector Technology; MP: USB1130-15-A; PACKAGE: None; PRICE: None; PURCHASE-URL: https://pricing.snapeda.com/search/part/USB1130-15-A/?ref=eda